# Altium schematic sheet altium.SchDoc
size A4
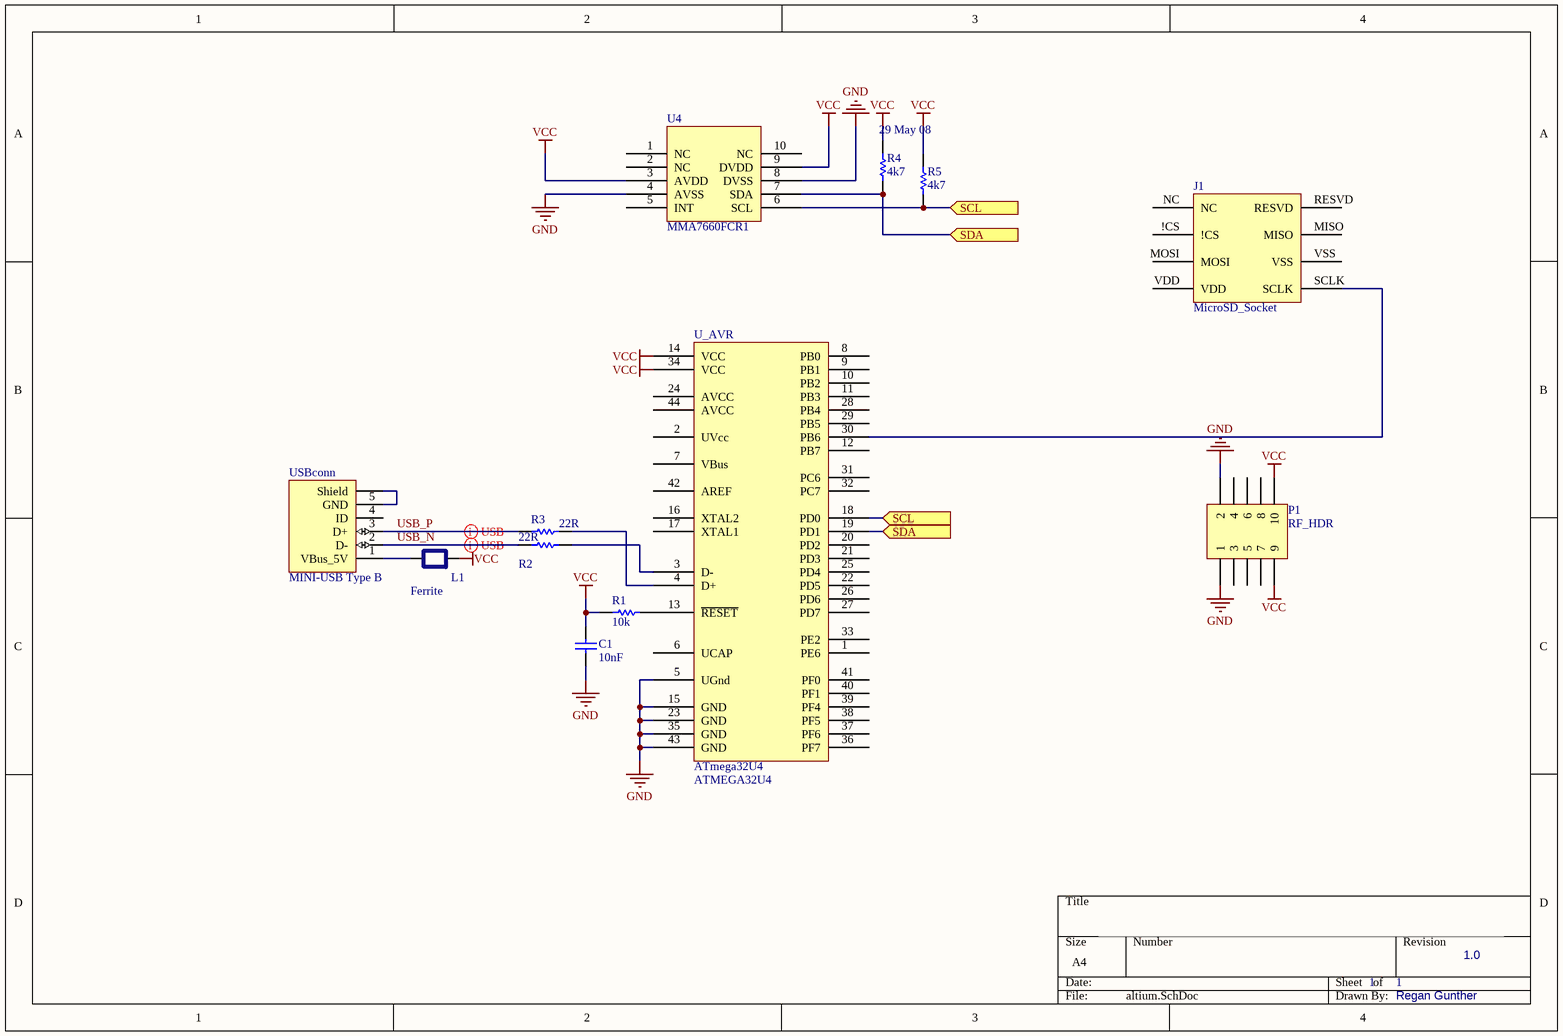
[diagram p0: altium.SchDoc]

## Parts
C1  10nF  [0603]
J1  MicroSD_Socket  [MicroSD]
L1  Ferrite  [0805]
P1  RF_HDR  [Header SMD 2x10 Female]
R1  10k  [0603]
R2  22R  [0603]
R3  22R  [0603]
R4  LatestRevisionDate: 29 May 08  [0603]  (hidden comment: 4k7)
R5  4k7  [0603]
U4  MMA7660FCR1  [DFN-10__MMA7660FCR1]
U_AVR  ATmega32U4  [TQFP-44]
USBconn  MINI-USB Type B  [USB-B SMD]

## Ports
SCL (in), SDA (in)

## Nets
GND: C1.2 P1.1 P1.2 U4.4(AVSS) U4.8(DVSS) U_AVR.5(UGnd) U_AVR.15(GND) U_AVR.23(GND) U_AVR.35(GND) U_AVR.43(GND)
VCC: C1.1 L1.2 P1.9 P1.10 R1.2 R4.2 R5.2 U4.3(AVDD) U4.9(DVDD) U_AVR.14(VCC) U_AVR.34(VCC)
SCL: R5.1 U4.6(SCL) U_AVR.18(PD0) ; port SCL
SDA: R4.1 U4.7(SDA) U_AVR.19(PD1) ; port SDA
USB_N: R2.1 USBconn.2(D-)
USB_P: R3.1 USBconn.3(D+)
NetJ1_SCLK: J1.SCLK U_AVR.30(PB6)
NetL1_1: L1.1 USBconn.1(VBus_5V)
NetR1_1: R1.1 U_AVR.13(~{RESET})
NetR2_2: R2.2 U_AVR.3(D-)
NetR3_2: R3.2 U_AVR.4(D+)
NetUSBconn_5: USBconn.5(GND) USBconn.6(Shield)

Not connected (* = marked no-connect by the designer): J1 !CS MISO MOSI NC RESVD VDD VSS; P1 3 4 5 6 7 8; U4 1(NC) 2(NC) 5(INT) 10(NC); U_AVR 1(PE6) 2(UVcc) 6(UCAP) 7(VBus) 8(PB0) 9(PB1) 10(PB2) 11(PB3) 12(PB7) 16(XTAL2) 17(XTAL1) 20(PD2) 21(PD3) 22(PD5) 24(AVCC) 25(PD4) 26(PD6) 27(PD7) 28(PB4) 29(PB5) 31(PC6) 32(PC7) 33(PE2) 36(PF7) 37(PF6) 38(PF5) 39(PF4) 40(PF1) 41(PF0) 42(AREF) 44(AVCC); USBconn 4(ID)

## Layout directives
differential pair: USB_N, USB_P

## Notes on the sheet
- 2.4GHz Radio Interface Board
- 1
- 1.0
- Regan Gunther

## Library data of the parts
C1 = CP_10nF 0603: CAP CER 10000PF 100V X7R 0603; Manufacturer: Taiyo Yuden; Manufacturer PN: HMK107B7103KA-T; Supplier 1: Digi-Key; Supplier Part Number 1: 587-1446-2-ND; Value: 10nF
L1 = IN_FERRITE CHIP 120 OHM 800mA 0805: FERRITE CHIP 120 OHM 800mA 0805; Manufacturer: TDK; Manufacturer PN: MMZ2012Y121B; Supplier 1: Digi-Key; Supplier Part Number 1: 445-2196-2-ND
P1 = Header 5X2: Header, 5-Pin, Dual row; LatestRevisionDate: 17-Jul-2002; LatestRevisionNote: Re-released for DXP Platform.; Publisher: Altium Limited
R1 = RS_10k 0603: RES 10.0K OHM 1/10W 1% 0603 SMD; Manufacturer: Yageo; Manufacturer PN: RC0603FR-0710KL; LatestRevisionDate: 29 May 08; Supplier 1: Digi-Key; Supplier Part Number 1: 311-10.0KHRTR-ND; Value: 10k
R2 R3 = RS_22R 0603: RES 22 OHM 1/10W 1% 0603 SMD; Manufacturer: Yageo; Manufacturer PN: RC0603JR-0722RL; LatestRevisionDate: 12 January 09; Supplier 1: Digi-Key; Supplier Part Number 1: 311-22GRTR-ND; Value: 22R
R4 R5 = RS_4k7 0603: RES 4.70K OHM 1/10W 1% 0603 SMD; Manufacturer: ROHM; Manufacturer PN: MCR03EZPFX4701; Supplier 1: Digi-Key; Supplier Part Number 1: RHM4.70KHTR-ND; Value: 4k7
  R5: LatestRevisionDate: 29 May 08
U_AVR = IC_ATmega32U4_44-TQFP: AVR 8-bit USB microcontroller; Supplier 1: Digi-Key; Supplier Part Number 1: ATMEGA32U4
USBconn = JP_MINIUSB type B_1: MINI-USB Type B Single Connector; Manufacturer PN: UX60-MB-5ST; Manufacturer: Hirose Electric Co Ltd; LatestRevisionDate: 29 May 08; Supplier Part Number 1: H2959CT-ND; Supplier 1: Digi-Key; Value: MINI-USB Type B